# Altium project thymio2-main.PrjPCB (part 1 of 2)
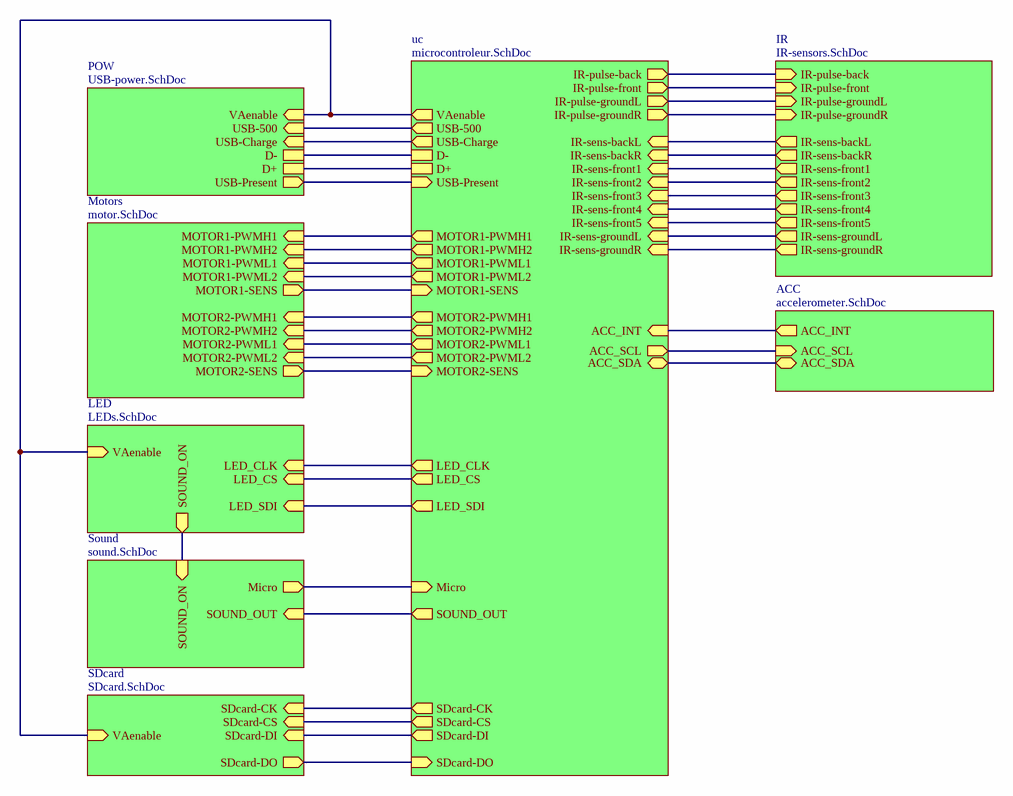
[diagram p0: thymio2-main.SchDoc]
Revision: 2.3
9 sheets, 376 parts. Net scope: hierarchical (ports join the sheet entries above them; power ports are global).
Board files: thymio2-main.PcbDoc, thymio2 capa touch round.PcbDoc
Sheets:
  thymio2-main.SchDoc
    uc = microcontroleur.SchDoc
    IR = IR-sensors.SchDoc
    POW = USB-power.SchDoc
    ACC = accelerometer.SchDoc
    LED = LEDs.SchDoc
    Motors = motor.SchDoc
    Sound = sound.SchDoc
    SDcard = SDcard.SchDoc

## Sheet thymio2-main.SchDoc: Thymio2
size A4; Organization: Original design LSRO-STI-EPFL; Address1: Association Mobsya; Address2: Michael Bonani; Address3: Ch. Closel 3; Address4: CH-1020 Renens; DocumentNumber: 1; Revision: 2.3; SheetNumber: 1; SheetTotal: 9; Engineer: Michael Bonani; Title2: PCB principal; ProjectName: Project Name

### Sub-sheets
ACC = accelerometer.SchDoc: ACC_INT (out), ACC_SCL (in), ACC_SDA (bidir)
IR = IR-sensors.SchDoc: IR-pulse-back (in), IR-pulse-front (in), IR-pulse-groundL (in), IR-pulse-groundR (in), IR-sens-backL (out), IR-sens-backR (out), IR-sens-front1 (out), IR-sens-front2 (out), IR-sens-front3 (out), IR-sens-front4 (out), IR-sens-front5 (out), IR-sens-groundL (out), IR-sens-groundR (out)
LED = LEDs.SchDoc: LED_CLK (in), LED_CS (in), LED_SDI (in), SOUND_ON (out), VAenable (in)
Motors = motor.SchDoc: MOTOR1-PWMH1 (in), MOTOR1-PWMH2 (in), MOTOR1-PWML1 (in), MOTOR1-PWML2 (in), MOTOR1-SENS (out), MOTOR2-PWMH1 (in), MOTOR2-PWMH2 (in), MOTOR2-PWML1 (in), MOTOR2-PWML2 (in), MOTOR2-SENS (out)
POW = USB-power.SchDoc: D+, D-, USB-500 (in), VAenable (in), USB-Charge (in), USB-Present (out)
SDcard = SDcard.SchDoc: SDcard-CK (in), SDcard-CS (in), SDcard-DI (in), SDcard-DO (out), VAenable (in)
Sound = sound.SchDoc: Micro (out), SOUND_ON (in), SOUND_OUT (in)
uc = microcontroleur.SchDoc: ACC_INT (in), ACC_SCL (out), ACC_SDA (bidir), IR-pulse-back (out), IR-pulse-front (out), IR-pulse-groundL (out), IR-pulse-groundR (out), IR-sens-backL (in), IR-sens-backR (in), IR-sens-front1 (in), IR-sens-front2 (in), IR-sens-front3 (in), IR-sens-front4 (in), IR-sens-front5 (in), IR-sens-groundL (in), IR-sens-groundR (in), MOTOR1-PWMH1 (out), MOTOR1-PWMH2 (out), MOTOR1-PWML1 (out), MOTOR1-PWML2 (out), MOTOR1-SENS (in), MOTOR2-PWMH1 (out), MOTOR2-PWMH2 (out), MOTOR2-PWML1 (out), MOTOR2-PWML2 (out), MOTOR2-SENS (in), D+, D-, USB-500 (out), VAenable (out), LED_CLK (out), LED_CS (out), LED_SDI (out), USB-Charge (out), Micro (in), SOUND_OUT (out), SDcard-CK (out), SDcard-CS (out), SDcard-DI (out), SDcard-DO (in), USB-Present (in)

### Nets
ACC_INT: sheet uc/ACC_INT, sheet ACC/ACC_INT
D_N: sheet uc/D-, sheet POW/D-
D_P: sheet uc/D+, sheet POW/D+
IR-pulse-back: sheet uc/IR-pulse-back, sheet IR/IR-pulse-back
IR-pulse-front: sheet uc/IR-pulse-front, sheet IR/IR-pulse-front
IR-pulse-groundL: sheet uc/IR-pulse-groundL, sheet IR/IR-pulse-groundL
IR-pulse-groundR: sheet uc/IR-pulse-groundR, sheet IR/IR-pulse-groundR
IR-sens-backL: sheet uc/IR-sens-backL, sheet IR/IR-sens-backL
IR-sens-backR: sheet uc/IR-sens-backR, sheet IR/IR-sens-backR
IR-sens-front1: sheet uc/IR-sens-front1, sheet IR/IR-sens-front1
IR-sens-front2: sheet uc/IR-sens-front2, sheet IR/IR-sens-front2
IR-sens-front3: sheet uc/IR-sens-front3, sheet IR/IR-sens-front3
IR-sens-front4: sheet uc/IR-sens-front4, sheet IR/IR-sens-front4
IR-sens-front5: sheet uc/IR-sens-front5, sheet IR/IR-sens-front5
IR-sens-groundL: sheet uc/IR-sens-groundL, sheet IR/IR-sens-groundL
IR-sens-groundR: sheet uc/IR-sens-groundR, sheet IR/IR-sens-groundR
LED_CLK: sheet uc/LED_CLK, sheet LED/LED_CLK
LED_CS: sheet uc/LED_CS, sheet LED/LED_CS
LED_SDI: sheet uc/LED_SDI, sheet LED/LED_SDI
Micro: sheet uc/Micro, sheet Sound/Micro
MOTOR1-PWMH1: sheet uc/MOTOR1-PWMH1, sheet Motors/MOTOR1-PWMH1
MOTOR1-PWMH2: sheet uc/MOTOR1-PWMH2, sheet Motors/MOTOR1-PWMH2
MOTOR1-PWML1: sheet uc/MOTOR1-PWML1, sheet Motors/MOTOR1-PWML1
MOTOR1-PWML2: sheet uc/MOTOR1-PWML2, sheet Motors/MOTOR1-PWML2
MOTOR1-SENS: sheet uc/MOTOR1-SENS, sheet Motors/MOTOR1-SENS
MOTOR2-PWMH1: sheet uc/MOTOR2-PWMH1, sheet Motors/MOTOR2-PWMH1
MOTOR2-PWMH2: sheet uc/MOTOR2-PWMH2, sheet Motors/MOTOR2-PWMH2
MOTOR2-PWML1: sheet uc/MOTOR2-PWML1, sheet Motors/MOTOR2-PWML1
MOTOR2-PWML2: sheet uc/MOTOR2-PWML2, sheet Motors/MOTOR2-PWML2
MOTOR2-SENS: sheet uc/MOTOR2-SENS, sheet Motors/MOTOR2-SENS
SCL: sheet uc/ACC_SCL, sheet ACC/ACC_SCL
SDA: sheet uc/ACC_SDA, sheet ACC/ACC_SDA
SDcard-CK: sheet uc/SDcard-CK, sheet SDcard/SDcard-CK
SDcard-CS: sheet uc/SDcard-CS, sheet SDcard/SDcard-CS
SDcard-DI: sheet uc/SDcard-DI, sheet SDcard/SDcard-DI
SDcard-DO: sheet uc/SDcard-DO, sheet SDcard/SDcard-DO
SOUND_ON: sheet LED/SOUND_ON, sheet Sound/SOUND_ON
SOUND_OUT: sheet uc/SOUND_OUT, sheet Sound/SOUND_OUT
USB-500: sheet uc/USB-500, sheet POW/USB-500
USB-Charge: sheet uc/USB-Charge, sheet POW/USB-Charge
USB-Present: sheet uc/USB-Present, sheet POW/USB-Present
VAenable: sheet uc/VAenable, sheet POW/VAenable, sheet LED/VAenable, sheet SDcard/VAenable

### Notes on the sheet
- Date:
- Project
- Part
- Revision:
- File :
- Page
- de

## Sheet microcontroleur.SchDoc: Thymio2
size A4; Organization: Original design LSRO-STI-EPFL; Address1: Association Mobsya; Address2: Michael Bonani; Address3: Ch. Closel 3; Address4: CH-1020 Renens; DocumentNumber: 2; Revision: 2.3; SheetNumber: 2; SheetTotal: 9; Engineer: Michael Bonani; Title2: PCB principal; ProjectName: Project Name
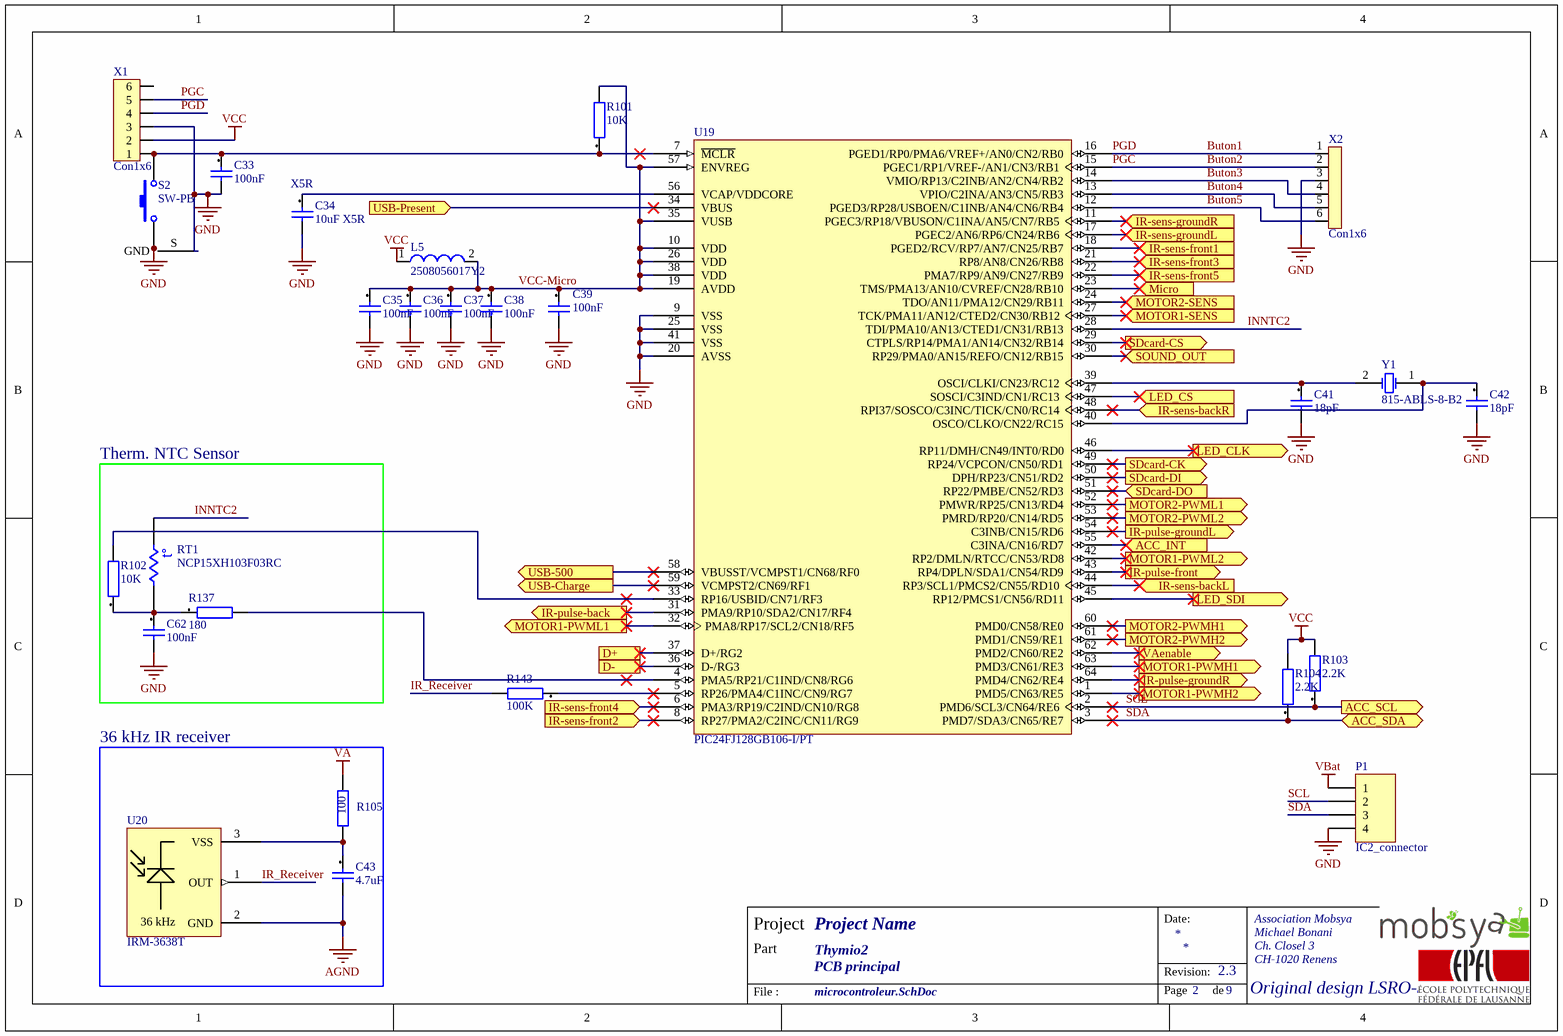
[diagram p1: microcontroleur.SchDoc]

### Parts
C33  100nF  [CAPC1005X05N]
C34  10uF X5R  Dielectric: X5R  [CAPC1005X05N]
C35  100nF  [CAPC1005X05N]
C36  100nF  [CAPC1005X05N]
C37  100nF  [CAPC1005X05N]
C38  100nF  [CAPC1005X05N]
C39  100nF  [CAPC1005X05N]
C41  18pF  [CAPC1005X05N]
C42  18pF  [CAPC1005X05N]
C43  4.7uF  [CAPC1005X05N]
C62  100nF  [CAPC1005X05N]
L5  2508056017Y2  [INDC2012X11L]
P1  IC2_connector  [HDR1X4]
R101  10K  [RESC1005X04N]
R102  10K  [RESC1005X04N]
R103  2.2K  [RESC1005X04N]
R104  2.2K  [RESC1005X04N]
R105  100  [RESC1005X04N]
R137  180  [RESC1005X04N]
R143  100K  [RESC1005X04N]
RT1  NCP15XH103F03RC  [RESC1005X04L]
S2  SW-PB  [FSMRA2JH]
U19  PIC24FJ128GB106-I/PT  [TQFP-PT64_N]
U20  IRM-3638T  [IR-receiver]
X1  Con1x6  [TYCO_7-215079-6]
X2  Con1x6  [MHDR1X6]
Y1  815-ABLS-8-B2  [HC49/4H_SMX]

### Blocks framed on the sheet
Therm. NTC Sensor: C62 R102 R137 RT1
36 kHz IR receiver: C43 R105 U20

### Ports
ACC_INT (in), ACC_SCL (out), ACC_SDA (bidir), D+, D-, IR-pulse-back (out), IR-pulse-front (out), IR-pulse-groundL (out), IR-pulse-groundR (out), IR-sens-backL (in), IR-sens-backR (in), IR-sens-front1 (in), IR-sens-front2 (in), IR-sens-front3 (in), IR-sens-front4 (in), IR-sens-front5 (in), IR-sens-groundL (in), IR-sens-groundR (in), LED_CLK (out), LED_CS (in), LED_SDI (out), Micro (in), MOTOR1-PWMH1 (out), MOTOR1-PWMH2 (out), MOTOR1-PWML1 (out), MOTOR1-PWML2 (out), MOTOR1-SENS (in), MOTOR2-PWMH1 (out), MOTOR2-PWMH2 (out), MOTOR2-PWML1 (out), MOTOR2-PWML2 (out), MOTOR2-SENS (in), SDcard-CK (out), SDcard-CS (out), SDcard-DI (out), SDcard-DO (in), SOUND_OUT (in), USB-500 (out), USB-Charge (out), USB-Present (in), VAenable (out)

### Nets
AGND: C43.2 U20.2(GND)
GND: C33.2 C34.2 C35.2 C36.2 C37.2 C38.2 C39.2 C41.2 C42.2 C62.2 P1.4 S2.1 S2.S(GND) U19.9(VSS) U19.20(AVSS) U19.25(VSS) U19.41(VSS) X1.3 X2.3
VA: R105.2
VBat: P1.1
VCC: L5.1 R103.2 R104.2 X1.2
ACC_INT: U19.55(C3INA/CN16/RD7) ; port ACC_INT
Buton1: U19.16(PGED1/RP0/PMA6/VREF+/AN0/CN2/RB0) X1.4 X2.1  [also labelled PGD]
Buton2: U19.15(PGEC1/RP1/VREF-/AN1/CN3/RB1) X1.5 X2.2  [also labelled PGC]
Buton3: U19.14(VMIO/RP13/C2INB/AN2/CN4/RB2) X2.4
Buton4: U19.13(VPIO/C2INA/AN3/CN5/RB3) X2.5
Buton5: U19.12(PGED3/RP28/USBOEN/C1INB/AN4/CN6/RB4) X2.6
D_N: U19.36(D-/RG3) ; port D-
D_P: U19.37(D+/RG2) ; port D+
INNTC2: RT1.1 U19.28(TDI/PMA10/AN13/CTED1/CN31/RB13)
IR-pulse-back: U19.31(PMA9/RP10/SDA2/CN17/RF4) ; port IR-pulse-back
IR-pulse-front: U19.43(RP4/DPLN/SDA1/CN54/RD9) ; port IR-pulse-front
IR-pulse-groundL: U19.54(C3INB/CN15/RD6) ; port IR-pulse-groundL
IR-pulse-groundR: U19.64(PMD4/CN62/RE4) ; port IR-pulse-groundR
IR-sens-backL: U19.44(RP3/SCL1/PMCS2/CN55/RD10) ; port IR-sens-backL
IR-sens-backR: U19.48(RPI37/SOSCO/C3INC/TICK/CN0/RC14) ; port IR-sens-backR
IR-sens-front1: U19.18(PGED2/RCV/RP7/AN7/CN25/RB7) ; port IR-sens-front1
IR-sens-front2: U19.8(RP27/PMA2/C2INC/CN11/RG9) ; port IR-sens-front2
IR-sens-front3: U19.21(RP8/AN8/CN26/RB8) ; port IR-sens-front3
IR-sens-front4: U19.6(PMA3/RP19/C2IND/CN10/RG8) ; port IR-sens-front4
IR-sens-front5: U19.22(PMA7/RP9/AN9/CN27/RB9) ; port IR-sens-front5
IR-sens-groundL: U19.17(PGEC2/AN6/RP6/CN24/RB6) ; port IR-sens-groundL
IR-sens-groundR: U19.11(PGEC3/RP18/VBUSON/C1INA/AN5/CN7/RB5) ; port IR-sens-groundR
IR_Receiver: R143.2 U20.1(OUT)
LED_CLK: U19.46(RP11/DMH/CN49/INT0/RD0) ; port LED_CLK
LED_CS: U19.47(SOSCI/C3IND/CN1/RC13) ; port LED_CS
LED_SDI: U19.45(RP12/PMCS1/CN56/RD11) ; port LED_SDI
Micro: U19.23(TMS/PMA13/AN10/CVREF/CN28/RB10) ; port Micro
MOTOR1-PWMH1: U19.63(PMD3/CN61/RE3) ; port MOTOR1-PWMH1
MOTOR1-PWMH2: U19.1(PMD5/CN63/RE5) ; port MOTOR1-PWMH2
MOTOR1-PWML1: U19.32(PMA8/RP17/SCL2/CN18/RF5) ; port MOTOR1-PWML1
MOTOR1-PWML2: U19.42(RP2/DMLN/RTCC/CN53/RD8) ; port MOTOR1-PWML2
MOTOR1-SENS: U19.27(TCK/PMA11/AN12/CTED2/CN30/RB12) ; port MOTOR1-SENS
MOTOR2-PWMH1: U19.60(PMD0/CN58/RE0) ; port MOTOR2-PWMH1
MOTOR2-PWMH2: U19.61(PMD1/CN59/RE1) ; port MOTOR2-PWMH2
MOTOR2-PWML1: U19.52(PMWR/RP25/CN13/RD4) ; port MOTOR2-PWML1
MOTOR2-PWML2: U19.53(PMRD/RP20/CN14/RD5) ; port MOTOR2-PWML2
MOTOR2-SENS: U19.24(TDO/AN11/PMA12/CN29/RB11) ; port MOTOR2-SENS
SCL: P1.2 R103.1 U19.2(PMD6/SCL3/CN64/RE6) ; port ACC_SCL
SDA: P1.3 R104.1 U19.3(PMD7/SDA3/CN65/RE7) ; port ACC_SDA
SDcard-CK: U19.49(RP24/VCPCON/CN50/RD1) ; port SDcard-CK
SDcard-CS: U19.29(CTPLS/RP14/PMA1/AN14/CN32/RB14) ; port SDcard-CS
SDcard-DI: U19.50(DPH/RP23/CN51/RD2) ; port SDcard-DI
SDcard-DO: U19.51(RP22/PMBE/CN52/RD3) ; port SDcard-DO
SOUND_OUT: U19.30(RP29/PMA0/AN15/REFO/CN12/RB15) ; port SOUND_OUT
USB-500: U19.58(VBUSST/VCMPST1/CN68/RF0) ; port USB-500
USB-Charge: U19.59(VCMPST2/CN69/RF1) ; port USB-Charge
USB-Present: U19.34(VBUS) ; port USB-Present
VAenable: U19.62(PMD2/CN60/RE2) ; port VAenable
VCC-Micro: C35.1 C36.1 C37.1 C38.1 C39.1 L5.2 R101.2 U19.10(VDD) U19.19(AVDD) U19.26(VDD) U19.35(VUSB) U19.38(VDD) U19.57(ENVREG)
NetC33_1: C33.1 R101.1 S2.2 U19.7(~{MCLR}) X1.1
NetC34_1: C34.1 U19.56(VCAP/VDDCORE)
NetC41_1: C41.1 U19.39(OSCI/CLKI/CN23/RC12) Y1.2(OSC2)
NetC42_1: C42.1 U19.40(OSCO/CLKO/CN22/RC15) Y1.1(OSC1)
NetC43_1: C43.1 R105.1 U20.3(VSS)
NetC62_1: C62.1 R102.1 R137.1 RT1.2
NetR102_2: R102.2 U19.33(RP16/USBID/CN71/RF3)
NetR137_2: R137.2 U19.4(PMA5/RP21/C1IND/CN8/RG6)
NetR143_1: R143.1 U19.5(RP26/PMA4/C1INC/CN9/RG7)

Not connected (* = marked no-connect by the designer): X1 6

### Notes on the sheet
- Date:
- Project
- Part
- Revision:
- File :
- Page
- de
- (in symbol Res Thermal) t°
- (in symbol TSOP32236) 36 kHz

### Library data of the parts
C33 C35-C39 C62 = 100nF[[/\]]0603[[/\]]1: Capacitor; Manufacturer: Kemet; Manufacturer Nr: C0603C104K5RAC; Preference: 1; Tolerance +: +10; Tolerance -: -10; Dielectric: X7R; Voltage: 50; MaxTemperature: +125; MinTemperature: -55; Quant_1: 10; Quant_2: 100; Quant_3: 1000; Quant_4: 4000; Currentie: CHF; LayerSch: Top; Size: 0603; Footprint Acort: 0603_G; Supplier: Farnell; Supplier Nr: 1288255; ComponentLink2Description: Farnell link; ComponentLink2URL: http://ch.farnell.com/jsp/displayProduct.jsp?sku=1288255; Price_1: 0.046; Price_2: 0.04; Price_3: 0.037; Price_4: 0.036; ROHS: True; DateLastUpdate: 2007-12-03 / 14:22:31
C34 = 10uF[[/\]]0603[[/\]]1: Capacitor; Manufacturer: Taiyo Yuden; Manufacturer Nr: JMK107BJ106MA-T; Preference: 1; Tolerance +: +15; Tolerance -: -15; Voltage: 6.3; MaxTemperature: +85; MinTemperature: -55; Quant_2: 100; Quant_3: 500; Currentie: CHF; LayerSch: Top; Size: 0603; Footprint Acort: 0603_G; Supplier: Farnell; Supplier Nr: 1463375; ComponentLink2Description: Farnell link; ComponentLink2URL: http://ch.farnell.com/jsp/displayProduct.jsp?sku=1463375; Quant_1: 1; Price_1: 0.768; Price_2: 0.674; Price_3: 0.372; ROHS: True; DateLastUpdate: 2007-12-03 / 14:22:36
C41 C42 = 10pF[[/\]]0603[[/\]]3: Manufacturer: Murata; Manufacturer Nr: GRM1885C1H100JA01D; Preference: 3; Tolerance +: +5; Tolerance -: -5; Dielectric: COG; Voltage: 50; MaxTemperature: +125; MinTemperature: -55; Quant_1: 10; Quant_2: 100; Quant_3: 500; Quant_4: 1000; Quant_5: 4000; Quant_6: 8000; Currentie: CHF; Size: 0603; Footprint Acort: 0603_G; Supplier: Farnell; Supplier Nr: 8819815; ComponentLink2Description: Farnell link; ComponentLink2URL: http://ch.farnell.com/jsp/displayProduct.jsp?sku=8819815; Price_1: 0.071; Price_2: 0.061; Price_3: 0.051; Price_4: 0.041; Price_5: 0.031; Price_6: 0.02; ROHS: True; DateLastUpdate: 2007-12-03 / 14:22:35
C43 = 4.7uF[[/\]]0603[[/\]]1: Capacitor; Manufacturer: Kemet; Manufacturer Nr: C0603C475K9PAC; Preference: 1; Tolerance +: +10; Tolerance -: -10; Dielectric: X5R; Voltage: 6.3; MaxTemperature: +85; MinTemperature: -55; Quant_1: 10; Quant_2: 100; Quant_3: 1000; Quant_4: 4000; Currentie: CHF; Size: 0603; Footprint Acort: 0603_G; Supplier: Farnell; Supplier Nr: 9227784; ComponentLink2Description: Farnell link; ComponentLink2URL: http://ch.farnell.com/jsp/displayProduct.jsp?sku=9227784; Price_1: 0.33; Price_2: 0.298; Price_3: 0.278; Price_4: 0.246; ROHS: True; DateLastUpdate: 2007-12-03 / 14:22:57
L5 = 74279204: SMD EMI Suppression Ferrite Bead WE-CBF, Z = 600 Ohm; Impedance: 600 Ohm; PackageReference: SMD-0805; PackageDescription: Chip Inductor, 2-Leads, Body 2.0 x 1.2 mm; PartNumber: 2508056017Y2; ComponentLink1Description: Fair-Rite; ComponentLink2Description: https://www.mouser.ch/datasheet/2/150/2508056017Y2-472219.pdf
P1 = Header 4: Header, 4-Pin; LatestRevisionDate: 17-Jul-2002; LatestRevisionNote: Re-released for DXP Platform.; Publisher: Altium Limited
R101 R102 = 10K[[/\]]0603[[/\]]2: Resistor; Manufacturer: Multicomp; Manufacturer Nr: MC 0.063W 0603 1% 10K; Tolerance: +/-1; Preference: 2; Power: 0.063; Voltage: 50; Current: 1; ppm/K: +/-100; Quant_2: 250; Quant_3: 1000; Quant_4: 5000; Quant_5: 15000; Currentie: CHF; LayerSch: Top; Size: 0603; Footprint Acort: 0603; ComponentLink1Description: OnLine datasheet; Supplier: Farnell; Supplier Nr: 9330399; ComponentLink2Description: Farnell link; ComponentLink2URL: http://ch.farnell.com/jsp/displayProduct.jsp?sku=9330399; ROHS: True; Quant_1: 50; Price_1: 0.062; Price_2: 0.049; Price_3: 0.038; Price_4: 0.027; Price_5: 0.021; DateLastUpdate: 2007-11-29 / 09:14:40
R103 R104 = 4.7K[[/\]]0603[[/\]]1: Resistor; Manufacturer: Vishay; Manufacturer Nr: D11CRCW06030B4701F; Tolerance: +/-1; Preference: 1; Power: 0.1; Voltage: 75; Current: 1.5; ppm/K: +/-100; Quant_1: 10; Quant_2: 100; Quant_3: 500; Currentie: CHF; LayerSch: Top; Size: 0603; Footprint Acort: 0603; Supplier: Distrelec; Supplier Nr: 715604; ComponentLink2Description: Distrelec link; ComponentLink2URL: http://www.distrelec.com/ishopWebFront/search/luceneSearch.do?dispatch=find&showImage=on&artnrPhrase=715604; ROHS: True; Price_1: 0.0538; Price_2: 0.0323; Price_3: 0.0204; DateLastUpdate: 2007-12-03 / 16:30:20
R105 = RES_ACORT: Resistance; ClassName: IR
R137 = 180R[[/\]]0603[[/\]]1: Resistor; Manufacturer: Vishay; Manufacturer Nr: D11CRCW06030B4703F; Tolerance: +/-1; Preference: 1; Power: 0.1; Voltage: 75; Current: 1.5; ppm/K: +/-100; Quant_1: 10; Quant_2: 100; Quant_3: 500; Currentie: CHF; LayerSch: Top; Size: 0603; Footprint Acort: 0603; Supplier: Distrelec; Supplier Nr: 715570; ComponentLink2Description: Distrelec link; ComponentLink2URL: http://www.distrelec.com/ishopWebFront/search/luceneSearch.do?dispatch=find&showImage=on&artnrPhrase=715570; ROHS: True; Price_1: 0.0538; Price_2: 0.0323; Price_3: 0.0204; DateLastUpdate: 2007-12-03 / 16:30:19
R143 = 100K[[/\]]0603[[/\]]1: Resistor; Manufacturer: Vishay; Manufacturer Nr: D11CRCW06030B1003F; Tolerance: +/-1; Preference: 1; Power: 0.1; Voltage: 75; Current: 1.5; ppm/K: +/-100; Quant_1: 10; Quant_2: 100; Quant_3: 500; Currentie: CHF; Size: 0603; Footprint Acort: 0603; ComponentLink1Description: OnLine datasheet; Supplier: Distrelec; Supplier Nr: 715636; ComponentLink2Description: Distrelec link; ComponentLink2URL: http://www.distrelec.com/ishopWebFront/search/luceneSearch.do?dispatch=find&showImage=on&artnrPhrase=715636; ROHS: True; Price_1: 0.0538; Price_2: 0.0323; Price_3: 0.0204; DateLastUpdate: 2007-12-03 / 16:29:58
RT1 = Res Thermal: Thermistors - NTC 10K OHM 1% 0402; LayerSch: Top; Published: 24-Mar-1999; LatestRevisionDate: 29-May-2009; LatestRevisionNote: IPC-7351 Footprint Added.; PackageVersion: Mar-2003; PackageReference: 6-0805; Publisher: Altium Limited; PackageDescription: Chip Resistor 0805 Case Size; Code_IPC: RESC2012
S2 = SW-PB: Switch; Published: 24-Mar-1999; LatestRevisionDate: 17-Jul-2002; LatestRevisionNote: Re-released for DXP Platform.; PackageReference: SPST-2; Publisher: Altium Limited
U19 = PIC24FJ128GB106-I/PT: General Purpose 16-Bit Flash Microcontroller with USB On-The-Go, 128KB Flash, 16KB SRAM, 64-Pin TQFP, Industrial Temperature; FirstPublished: 29-Jan-2009; DatasheetVersion: revB, Mar-2008; PackageVersion: revBB, Aug-2009; PackageReference: TQFP-PT64; Publisher: Altium Limited; PackageDescription: 64-Lead Thin Plastic Quad Flat Pack (PT) - 10x10x1mm Body, 2.00mm [TQFP]; Supplier 1: Digi-Key; Supplier Part Number 1: PIC24FJ128GB106-I/PT-ND; Supplier 2: Farnell; Supplier Part Number 2: 1576850; Supplier 3: Newark; Supplier Part Number 3: 54M5097; Code_JEDEC: MS-026; ComponentLink1Description: Datasheet; ComponentLink1URL: http://ww1.microchip.com/downloads/en/DeviceDoc/39897b.pdf; ComponentLink2Description: Packaging Specification; ComponentLink2URL: http://www.microchip.com/stellent/groups/techpub_sg/documents/packagingspec/en012702.pdf; ComponentLink3Description: Microchip.com Home; ComponentLink3URL: http://www.microchip.com/
U20 = TSOP32236: IR Receiver Module (38 kHz) for Remote Control Systems; LayerSch: Top; Farnell: 4913103; ClassName: IR
X1 = Con1x6_1: 1 x 6 pins connector
X2 = Con1x6: 1 x 6 pins connector; LayerSch: Top
Y1 = HC49/4H_SMX: Surface Mount Quartz Crystal 8Mhz; Note: PCB layout complies with manufacturer's recommendation.; Published: 17-Jul-2002; DatasheetDocument: 18-Oct-1999; PackageDocument: 18-Oct-1999; PackageReference: HC49/4H_SMX; Publisher: Altium Limited; ComponentLink1Description: Manufacturer Link; ComponentLink1URL: http://www.cmac.com/mt/; ComponentLink2Description: Datasheet; ComponentLink2URL: http://www.cmac.com/mt/databook/crystals/smd/hc49_4h_smx.pdf

## Sheet IR-sensors.SchDoc: Thymio2
size A3; Organization: Original design LSRO-STI-EPFL; Address1: Association Mobsya; Address2: Michael Bonani; Address3: Ch. Closel 3; Address4: CH-1020 Renens; DocumentNumber: 4; Revision: 2.3; SheetNumber: 4; SheetTotal: 9; Engineer: Michael Bonani; Title2: PCB principal; ProjectName: Project Name
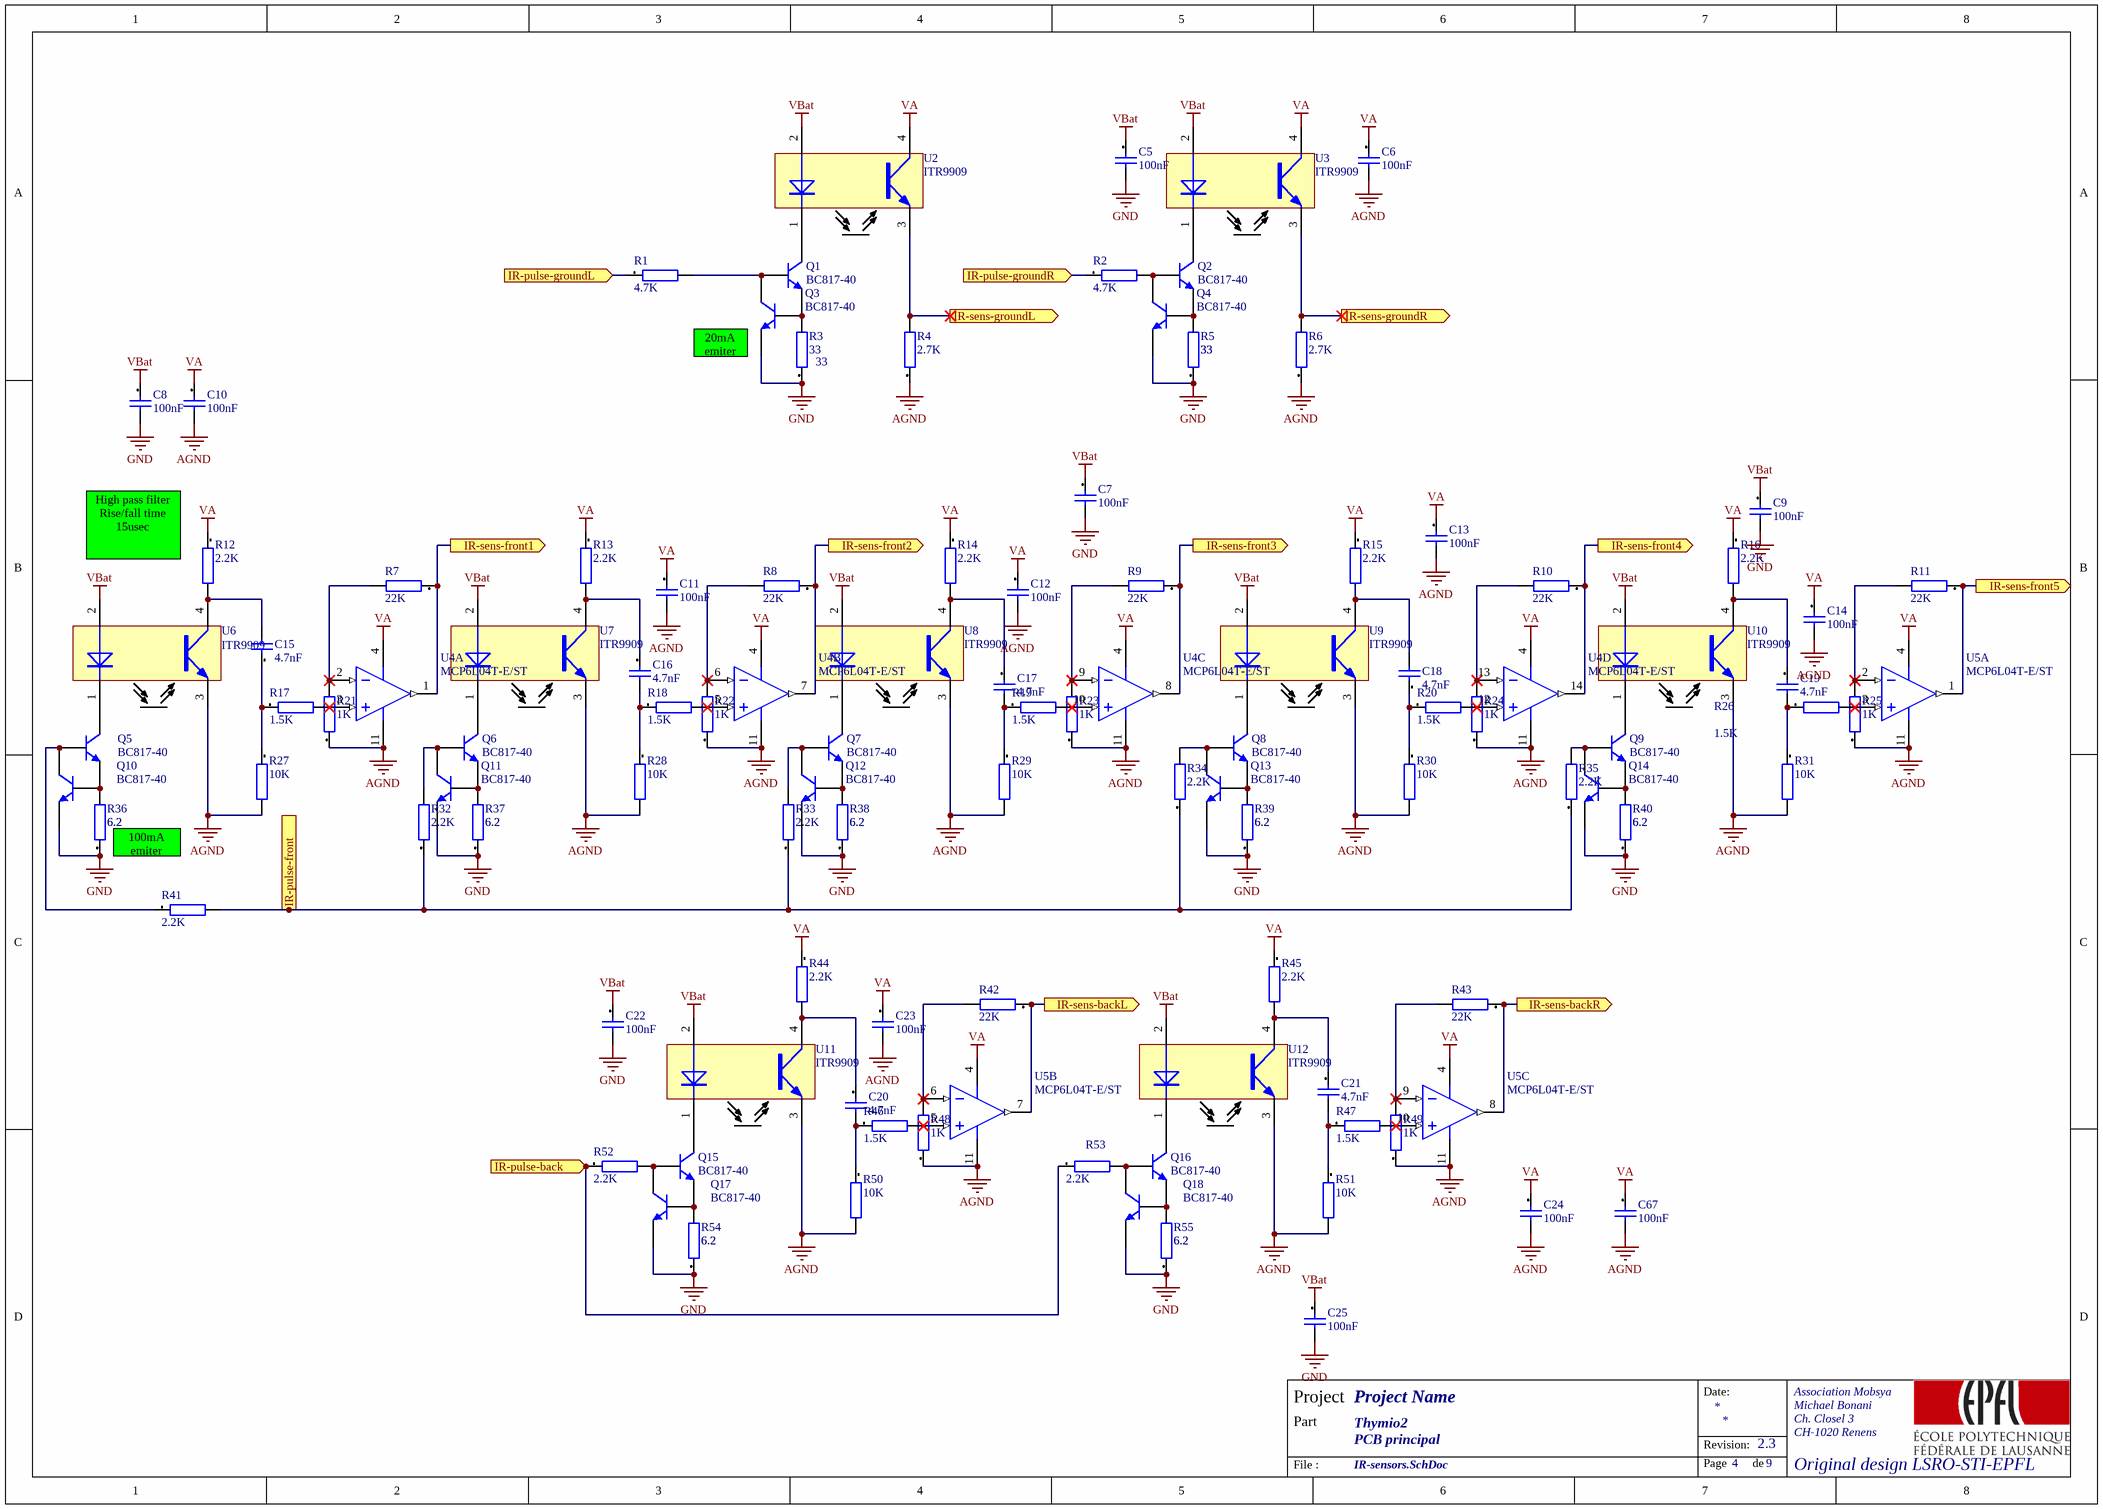
[diagram p2: IR-sensors.SchDoc]

### Parts
C5  100nF  [CAPC1005X05N]
C6  100nF  [CAPC1005X05N]
C7  100nF  [CAPC1005X05N]
C8  100nF  [CAPC1005X05N]
C9  100nF  [CAPC1005X05N]
C10  100nF  [CAPC1005X05N]
C11  100nF  [CAPC1005X05N]
C12  100nF  [CAPC1005X05N]
C13  100nF  [CAPC1005X05N]
C14  100nF  [CAPC1005X05N]
C15  4.7nF  [CAPC1005X05N]
C16  4.7nF  [CAPC1005X05N]
C17  4.7nF  [CAPC1005X05N]
C18  4.7nF  [CAPC1005X05N]
C19  4.7nF  [CAPC1005X05N]
C20  4.7nF  [CAPC1005X05N]
C21  4.7nF  [CAPC1005X05N]
C22  100nF  [CAPC1005X05N]
C23  100nF  [CAPC1005X05N]
C24  100nF  [CAPC1005X05N]
C25  100nF  [CAPC1005X05N]
C67  100nF  [CAPC1005X05N]
Q1  BC817-40  [SOT23_N]
Q2  BC817-40  [SOT23_N]
Q3  BC817-40  [SOT23_N]
Q4  BC817-40  [SOT23_N]
Q5  BC817-40  [SOT23_N]
Q6  BC817-40  [SOT23_N]
Q7  BC817-40  [SOT23_N]
Q8  BC817-40  [SOT23_N]
Q9  BC817-40  [SOT23_N]
Q10  BC817-40  [SOT23_N]
Q11  BC817-40  [SOT23_N]
Q12  BC817-40  [SOT23_N]
Q13  BC817-40  [SOT23_N]
Q14  BC817-40  [SOT23_N]
Q15  BC817-40  [SOT23_N]
Q16  BC817-40  [SOT23_N]
Q17  BC817-40  [SOT23_N]
Q18  BC817-40  [SOT23_N]
R1  4.7K  [RESC1005X04N]
R2  4.7K  [RESC1005X04N]
R3  33  [RESC1005X04N]
R4  2.7K  [RESC1005X04N]
R5  33  [RESC1005X04N]
R6  2.7K  [RESC1005X04N]
R7  22K  [RESC1005X04N]
R8  22K  [RESC1005X04N]
R9  22K  [RESC1005X04N]
R10  22K  [RESC1005X04N]
R11  22K  [RESC1005X04N]
R12  2.2K  [RESC1005X04N]
R13  2.2K  [RESC1005X04N]
R14  2.2K  [RESC1005X04N]
R15  2.2K  [RESC1005X04N]
R16  2.2K  [RESC1005X04N]
R17  1.5K  [RESC1005X04N]
R18  1.5K  [RESC1005X04N]
R19  1.5K  [RESC1005X04N]
R20  1.5K  [RESC1005X04N]
R21  1K  [RESC1005X04N]
R22  1K  [RESC1005X04N]
R23  1K  [RESC1005X04N]
R24  1K  [RESC1005X04N]
R25  1K  [RESC1005X04N]
R26  1.5K  [RESC1005X04N]
R27  10K  [RESC1005X04N]
R28  10K  [RESC1005X04N]
R29  10K  [RESC1005X04N]
R30  10K  [RESC1005X04N]
R31  10K  [RESC1005X04N]
R32  2.2K  [RESC1005X04N]
R33  2.2K  [RESC1005X04N]
R34  2.2K  [RESC1005X04N]
R35  2.2K  [RESC1005X04N]
R36  6.2  [RESC1005X04N]
R37  6.2  [RESC1005X04N]
R38  6.2  [RESC1005X04N]
R39  6.2  [RESC1005X04N]
R40  6.2  [RESC1005X04N]
R41  2.2K  [RESC1005X04N]
R42  22K  [RESC1005X04N]
R43  22K  [RESC1005X04N]
R44  2.2K  [RESC1005X04N]
R45  2.2K  [RESC1005X04N]
R46  1.5K  [RESC1005X04N]
R47  1.5K  [RESC1005X04N]
R48  1K  [RESC1005X04N]
R49  1K  [RESC1005X04N]
R50  10K  [RESC1005X04N]
R51  10K  [RESC1005X04N]
R52  2.2K  [RESC1005X04N]
R53  2.2K  [RESC1005X04N]
R54  6.2  [RESC1005X04N]
R55  6.2  [RESC1005X04N]
U2  ITR9909  [ITR9909_LONG]
U3  ITR9909  [ITR9909_LONG]
U4  MCP6L04T-E/ST  [TSSOP-ST14_N]  (parts A,B,C,D of 4)
U5  MCP6L04T-E/ST  [TSSOP-ST14_N]  (parts A,B,C of 4)
U6  ITR9909  [ITR9909_EDGE]
U7  ITR9909  [ITR9909_EDGE]
U8  ITR9909  [ITR9909_EDGE]
U9  ITR9909  [ITR9909_EDGE]
U10  ITR9909  [ITR9909_EDGE]
U11  ITR9909  [ITR9909_EDGE]
U12  ITR9909  [ITR9909_EDGE]

### Ports
IR-pulse-back (in), IR-pulse-front (in), IR-pulse-groundL (in), IR-pulse-groundR (in), IR-sens-backL (out), IR-sens-backR (out), IR-sens-front1 (out), IR-sens-front2 (out), IR-sens-front3 (out), IR-sens-front4 (out), IR-sens-front5 (out), IR-sens-groundL (out), IR-sens-groundR (out)

### Nets
AGND: C6.2 C10.2 C11.2 C12.2 C13.2 C14.2 C23.2 C24.2 C67.2 R4.1 R6.1 R21.1 R22.1 R23.1 R24.1 R25.1 R27.2 R28.2 R29.2 R30.2 R31.2 R48.1 R49.1 R50.2 R51.2 U4.11(VSS) U5.11(VSS) U6.3(E) U7.3(E) U8.3(E) U9.3(E) U10.3(E) U11.3(E) U12.3(E)
GND: C5.2 C7.2 C8.2 C9.2 C22.2 C25.2 Q3.2(E) Q4.2(E) Q10.2(E) Q11.2(E) Q12.2(E) Q13.2(E) Q14.2(E) Q17.2(E) Q18.2(E) R3.1 R5.1 R36.1 R37.1 R38.1 R39.1 R40.1 R54.1 R55.1
VA: C6.1 C10.1 C11.1 C12.1 C13.1 C14.1 C23.1 C24.1 C67.1 R12.1 R13.1 R14.1 R15.1 R16.1 R44.1 R45.1 U2.4(C) U3.4(C) U4.4(VDD) U5.4(VDD)
VBat: C5.1 C7.1 C8.1 C9.1 C22.1 C25.1 U2.2(A) U3.2(A) U6.2(A) U7.2(A) U8.2(A) U9.2(A) U10.2(A) U11.2(A) U12.2(A)
IR-pulse-back: R52.1 R53.1 ; port IR-pulse-back
IR-pulse-front: R32.1 R33.1 R34.1 R35.1 R41.2 ; port IR-pulse-front
IR-pulse-groundL: R1.1 ; port IR-pulse-groundL
IR-pulse-groundR: R2.1 ; port IR-pulse-groundR
IR-sens-backL: R42.1 U5.7(VOUTB) ; port IR-sens-backL
IR-sens-backR: R43.1 U5.8(VOUTC) ; port IR-sens-backR
IR-sens-front1: R7.1 U4.1(VOUTA) ; port IR-sens-front1
IR-sens-front2: R8.1 U4.7(VOUTB) ; port IR-sens-front2
IR-sens-front3: R9.1 U4.8(VOUTC) ; port IR-sens-front3
IR-sens-front4: R10.1 U4.14(VOUTD) ; port IR-sens-front4
IR-sens-front5: R11.1 U5.1(VOUTA) ; port IR-sens-front5
IR-sens-groundL: R4.2 U2.3(E) ; port IR-sens-groundL
IR-sens-groundR: R6.2 U3.3(E) ; port IR-sens-groundR
NetC15_1: C15.1 R17.1 R27.1
NetC15_2: C15.2 R12.2 U6.4(C)
NetC16_1: C16.1 R13.2 U7.4(C)
NetC16_2: C16.2 R18.1 R28.1
NetC17_1: C17.1 R14.2 U8.4(C)
NetC17_2: C17.2 R19.1 R29.1
NetC18_1: C18.1 R20.1 R30.1
NetC18_2: C18.2 R15.2 U9.4(C)
NetC19_1: C19.1 R16.2 U10.4(C)
NetC19_2: C19.2 R26.1 R31.1
NetC20_1: C20.1 R44.2 U11.4(C)
NetC20_2: C20.2 R46.1 R50.1
NetC21_1: C21.1 R45.2 U12.4(C)
NetC21_2: C21.2 R47.1 R51.1
NetQ1_1: Q1.1(B) Q3.3(C) R1.2
NetQ1_2: Q1.2(E) Q3.1(B) R3.2
NetQ1_3: Q1.3(C) U2.1(C)
NetQ2_1: Q2.1(B) Q4.3(C) R2.2
NetQ2_2: Q2.2(E) Q4.1(B) R5.2
NetQ2_3: Q2.3(C) U3.1(C)
NetQ5_1: Q5.1(B) Q10.3(C) R41.1
NetQ5_2: Q5.2(E) Q10.1(B) R36.2
NetQ5_3: Q5.3(C) U6.1(C)
NetQ6_1: Q6.1(B) Q11.3(C) R32.2
NetQ6_2: Q6.2(E) Q11.1(B) R37.2
NetQ6_3: Q6.3(C) U7.1(C)
NetQ7_1: Q7.1(B) Q12.3(C) R33.2
NetQ7_2: Q7.2(E) Q12.1(B) R38.2
NetQ7_3: Q7.3(C) U8.1(C)
NetQ8_1: Q8.1(B) Q13.3(C) R34.2
NetQ8_2: Q8.2(E) Q13.1(B) R39.2
NetQ8_3: Q8.3(C) U9.1(C)
NetQ9_1: Q9.1(B) Q14.3(C) R35.2
NetQ9_2: Q9.2(E) Q14.1(B) R40.2
NetQ9_3: Q9.3(C) U10.1(C)
NetQ15_1: Q15.1(B) Q17.3(C) R52.2
NetQ15_2: Q15.2(E) Q17.1(B) R54.2
NetQ15_3: Q15.3(C) U11.1(C)
NetQ16_1: Q16.1(B) Q18.3(C) R53.2
NetQ16_2: Q16.2(E) Q18.1(B) R55.2
NetQ16_3: Q16.3(C) U12.1(C)
NetR7_2: R7.2 R21.2 U4.2(VINA-)
NetR8_2: R8.2 R22.2 U4.6(VINB-)
NetR9_2: R9.2 R23.2 U4.9(VINC-)
NetR10_2: R10.2 R24.2 U4.13(VIND-)
NetR11_2: R11.2 R25.2 U5.2(VINA-)
NetR17_2: R17.2 U4.3(VINA+)
NetR18_2: R18.2 U4.5(VINB+)
NetR19_2: R19.2 U4.10(VINC+)
NetR20_2: R20.2 U4.12(VIND+)
NetR26_2: R26.2 U5.3(VINA+)
NetR42_2: R42.2 R48.2 U5.6(VINB-)
NetR43_2: R43.2 R49.2 U5.9(VINC-)
NetR46_2: R46.2 U5.5(VINB+)
NetR47_2: R47.2 U5.10(VINC+)

### Notes on the sheet
- (near Q3) 20mA emiter
- (near R12) High pass filter
  Rise/fall time 15usec
- (near R36) 100mA emiter
- Date:
- Project
- Part
- Revision:
- File :
- Page
- de

### Library data of the parts
C5 C7-C9 C14 C22 C25 = 100nF[[/\]]0603[[/\]]1: Capacitor; Manufacturer: Kemet; Manufacturer Nr: C0603C104K5RAC; Preference: 1; Tolerance +: +10; Tolerance -: -10; Dielectric: X7R; Voltage: 50; MaxTemperature: +125; MinTemperature: -55; Quant_1: 10; Quant_2: 100; Quant_3: 1000; Quant_4: 4000; Currentie: CHF; Size: 0603; Footprint Acort: 0603_G; Supplier: Farnell; Supplier Nr: 1288255; ComponentLink2Description: Farnell link; ComponentLink2URL: http://ch.farnell.com/jsp/displayProduct.jsp?sku=1288255; Price_1: 0.046; Price_2: 0.04; Price_3: 0.037; Price_4: 0.036; ROHS: True; DateLastUpdate: 2007-12-03 / 14:22:31
C6 C10-C13 C23 C24 C67 = 100nF[[/\]]0603[[/\]]1: as C33 on sheet microcontroleur; Size: 0603; Footprint Acort: 0603_G; Supplier: Farnell; Supplier Nr: 1288255; ComponentLink2Description: Farnell link; ComponentLink2URL: http://ch.farnell.com/jsp/displayProduct.jsp?sku=1288255; Price_1: 0.046; Price_2: 0.04; Price_3: 0.037; Price_4: 0.036; ROHS: True; DateLastUpdate: 2007-12-03 / 14:22:31
C15-C21 = CAP-NP: Capacitor
Q1-Q4 Q7 Q12 = BC817-40: NPN General-purpose Transistor; Published: 17-Sep-2003; LatestRevisionDate: 12-Dec-2006; LatestRevisionNote: IPC-7351 Footprint Added.; DatasheetVersion: Jun-1999; PackageVersion: May-1999; PackageReference: SOT23; Publisher: Altium Limited; PackageDescription: 3-Pin SOT-23 Package 0.95 mm Pitch, 2.3 mm Lead Span; ComponentLink1Description: Manufacturer Link; ComponentLink1URL: http://www.semiconductors.philips.com/; ComponentLink2Description: Datasheet; ComponentLink2URL: http://www.semiconductors.philips.com/acrobat/datasheets/BC817_BC817W_BC337_5.pdf
Q5 Q6 Q8-Q11 Q13-Q18 = BC817-40: NPN General-purpose Transistor; LayerSch: Top; Published: 17-Sep-2003; LatestRevisionDate: 12-Dec-2006; LatestRevisionNote: IPC-7351 Footprint Added.; DatasheetVersion: Jun-1999; PackageVersion: May-1999; PackageReference: SOT23; Publisher: Altium Limited; PackageDescription: 3-Pin SOT-23 Package 0.95 mm Pitch, 2.3 mm Lead Span; ComponentLink1Description: Manufacturer Link; ComponentLink1URL: http://www.semiconductors.philips.com/; ComponentLink2Description: Datasheet; ComponentLink2URL: http://www.semiconductors.philips.com/acrobat/datasheets/BC817_BC817W_BC337_5.pdf
R1 R2 = 4.7K[[/\]]0603[[/\]]1: Resistor; Manufacturer: Vishay; Manufacturer Nr: D11CRCW06030B4701F; Tolerance: +/-1; Preference: 1; Power: 0.1; Voltage: 75; Current: 1.5; ppm/K: +/-100; Quant_1: 10; Quant_2: 100; Quant_3: 500; Currentie: CHF; Size: 0603; Footprint Acort: 0603; Supplier: Distrelec; Supplier Nr: 715604; ComponentLink2Description: Distrelec link; ComponentLink2URL: http://www.distrelec.com/ishopWebFront/search/luceneSearch.do?dispatch=find&showImage=on&artnrPhrase=715604; ROHS: True; Price_1: 0.0538; Price_2: 0.0323; Price_3: 0.0204; DateLastUpdate: 2007-12-03 / 16:30:20
R3 R7-R10 R12-R24 R27-R31 R38 R44 R45 R50 R51 = RES: 120
  R3: Value: 33
  R7-R10: Value: 22k
  R12-R16 R44 R45: Value: 2.2k
  R17-R20: Value: 1.5k
  R21-R24: Value: 1k
  R27-R31 R50 R51: Value: 10k
  R38: Value: 6.2
R4 R6 = RES: Resistor; Value: 1k
R5 = RES: Resistor; Value: 33
R11 R25 R26 R36 R37 R39 R40 R42 R43 R46-R49 R54 R55 = RES: 120; LayerSch: Top
  R11 R42 R43: Value: 22k
  R25 R48 R49: Value: 1k
  R26 R46 R47: Value: 1.5k
  R36 R37 R39 R40 R54 R55: Value: 6.2
R32 R34 R35 R41 R52 R53 = 2.2K[[/\]]0603[[/\]]1: Resistor; Manufacturer: Vishay; Manufacturer Nr: D11CRCW06030B2201F; Tolerance: +/-1; Preference: 1; Power: 0.1; Voltage: 75; Current: 1.5; ppm/K: +/-100; Quant_1: 10; Quant_2: 100; Quant_3: 500; Currentie: CHF; LayerSch: Top; Size: 0603; Footprint Acort: 0603; Supplier: Distrelec; Supplier Nr: 715596; ComponentLink2Description: Distrelec link; ComponentLink2URL: http://www.distrelec.com/ishopWebFront/search/luceneSearch.do?dispatch=find&showImage=on&artnrPhrase=715596; ROHS: True; Price_1: 0.085; Price_2: 0.0603; Price_3: 0.0247; DateLastUpdate: 2009-06-10 / 12:36:43
R33 = 2.2K[[/\]]0603[[/\]]1: Resistor; Manufacturer: Vishay; Manufacturer Nr: D11CRCW06030B2201F; Tolerance: +/-1; Preference: 1; Power: 0.1; Voltage: 75; Current: 1.5; ppm/K: +/-100; Quant_1: 10; Quant_2: 100; Quant_3: 500; Currentie: CHF; Size: 0603; Footprint Acort: 0603; Supplier: Distrelec; Supplier Nr: 715596; ComponentLink2Description: Distrelec link; ComponentLink2URL: http://www.distrelec.com/ishopWebFront/search/luceneSearch.do?dispatch=find&showImage=on&artnrPhrase=715596; ROHS: True; Price_1: 0.085; Price_2: 0.0603; Price_3: 0.0247; DateLastUpdate: 2009-06-10 / 12:36:43
U2 U3 = ITR9909: Everlight Opto Interrupter
U4 = MCP6L04T-E/ST: 1 MHz, 85 µA Quad Op Amp, 14-Pin TSSOP, Extended Temperature Range, Tape and Reel; FirstPublished: 2-Dec-2009; DatasheetVersion: revA, Mar-2009; PackageVersion: revBB, Aug-2009; PackageReference: TSSOP-ST14; Publisher: Altium Limited; PackageDescription: 14-Lead Plastic Thin Shrink Small Outline (ST) - 4.4mm Body [TSSOP]; Supplier 1: Digi-Key; Supplier Part Number 1: MCP6L04T-E/STTR-ND; Supplier 2: Digi-Key; Supplier Part Number 2: MCP6L04T-E/STDKR-ND; Supplier 3: Digi-Key; Supplier Part Number 3: MCP6L04T-E/STCT-ND; Supplier 4: Newark; Supplier Part Number 4: 08R1815; ComponentLink1Description: Datasheet; ComponentLink1URL: http://ww1.microchip.com/downloads/en/DeviceDoc/22140a.pdf; ComponentLink2Description: Packaging Specification; ComponentLink2URL: http://www.microchip.com/stellent/groups/techpub_sg/documents/packagingspec/en012702.pdf; ComponentLink3Description: Microchip.com Home; ComponentLink3URL: http://www.microchip.com/
U5 = MCP6L04T-E/ST: 1 MHz, 85 µA Quad Op Amp, 14-Pin TSSOP, Extended Temperature Range, Tape and Reel; LayerSch: Top; FirstPublished: 2-Dec-2009; DatasheetVersion: revA, Mar-2009; PackageVersion: revBB, Aug-2009; PackageReference: TSSOP-ST14; Publisher: Altium Limited; PackageDescription: 14-Lead Plastic Thin Shrink Small Outline (ST) - 4.4mm Body [TSSOP]; Supplier 1: Digi-Key; Supplier Part Number 1: MCP6L04T-E/STTR-ND; Supplier 2: Digi-Key; Supplier Part Number 2: MCP6L04T-E/STDKR-ND; Supplier 3: Digi-Key; Supplier Part Number 3: MCP6L04T-E/STCT-ND; Supplier 4: Newark; Supplier Part Number 4: 08R1815; ComponentLink1Description: Datasheet; ComponentLink1URL: http://ww1.microchip.com/downloads/en/DeviceDoc/22140a.pdf; ComponentLink2Description: Packaging Specification; ComponentLink2URL: http://www.microchip.com/stellent/groups/techpub_sg/documents/packagingspec/en012702.pdf; ComponentLink3Description: Microchip.com Home; ComponentLink3URL: http://www.microchip.com/
U6-U12 = ITR9909: Everlight Opto Interrupter; LayerSch: Top

## Sheet USB-power.SchDoc: Thymio2
size A4; Organization: Original design LSRO-STI-EPFL; Address1: Association Mobsya; Address2: Michael Bonani; Address3: Ch. Closel 3; Address4: CH-1020 Renens; DocumentNumber: 3; Revision: 2.3; SheetNumber: 3; SheetTotal: 9; Engineer: Michael Bonani; Title2: PCB principal; ProjectName: Project Name
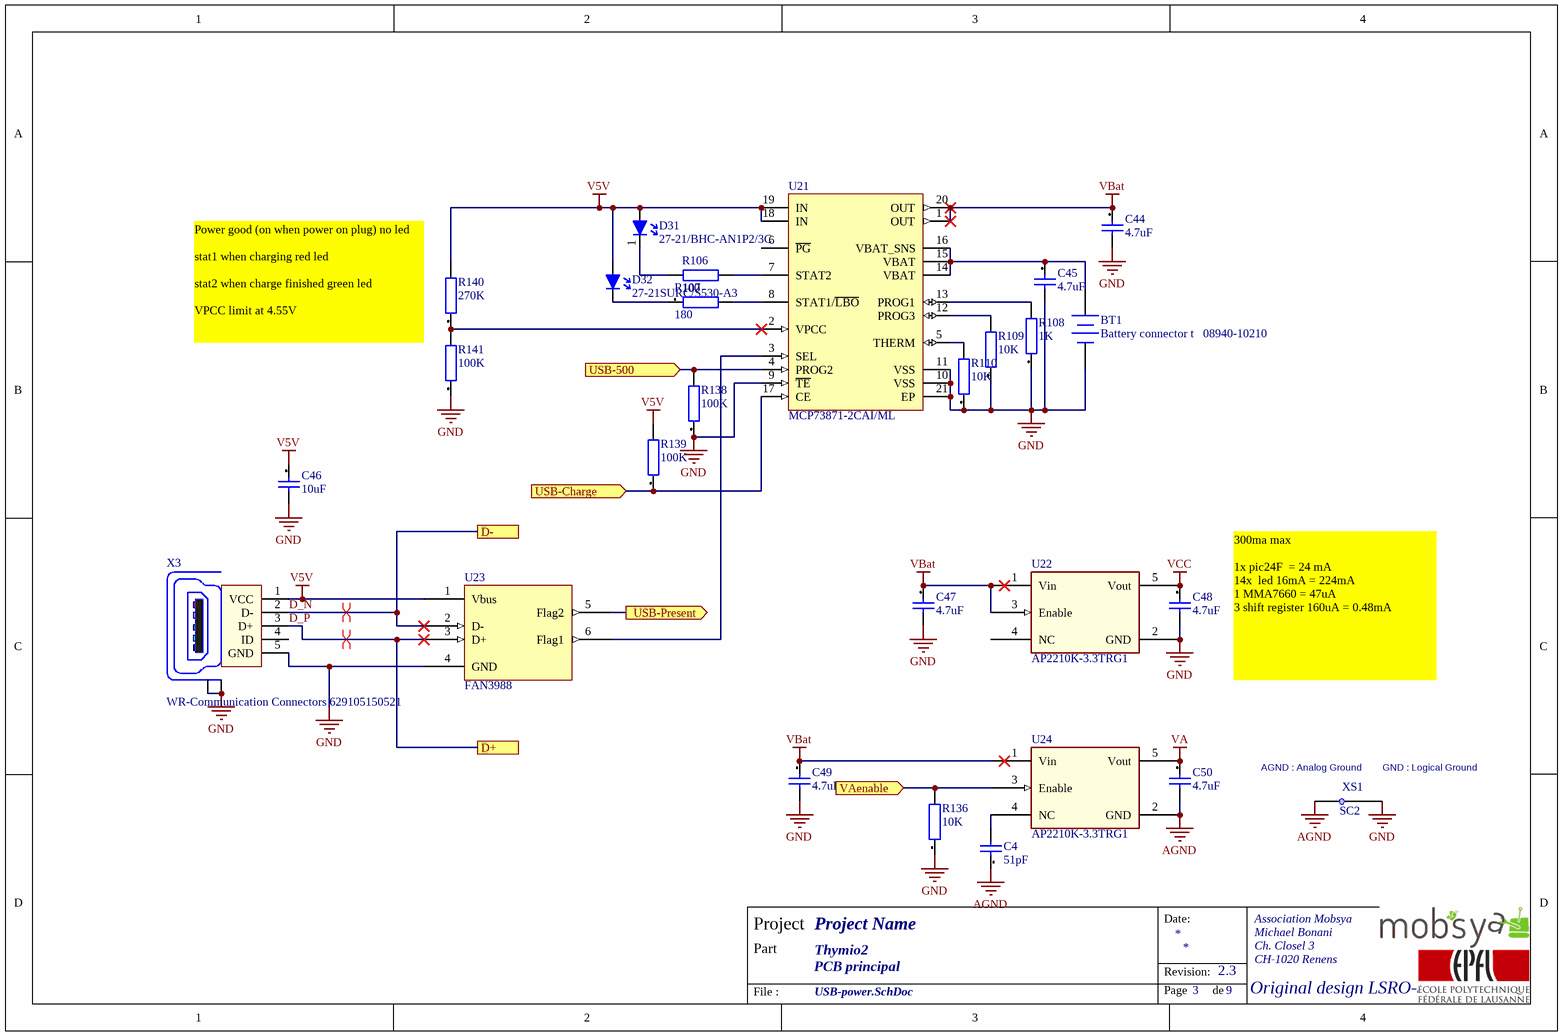
[diagram p3: USB-power.SchDoc]

### Parts
BT1  Battery connector t   08940-10210  [BAT-2]
C4  51pF  [CAPC1005X05N]
C44  4.7uF  [CAPC1005X05N]
C45  4.7uF  [CAPC1005X05N]
C46  10uF  [CAPC1005X05N]
C47  4.7uF  [CAPC1005X05N]
C48  4.7uF  [CAPC1005X05N]
C49  4.7uF  [CAPC1005X05N]
C50  4.7uF  [CAPC1005X05N]
D31  27-21/BHC-AN1P2/3C  [27-21 Everlight Blue]
D32  27-21SURC/S530-A3  [27-21 Everlight]
R106  100  [RESC1005X04N]
R107  180  [RESC1005X04N]
R108  1K  [RESC1005X04N]
R109  10K  [RESC1005X04N]
R110  10K  [RESC1005X04N]
R136  10K  [RESC1005X04N]
R138  100K  [RESC1005X04N]
R139  100K  [RESC1005X04N]
R140  270K  [RESC1005X04N]
R141  100K  [RESC1005X04N]
U21  MCP73871-2CAI/ML  [QFN-ML20_N]
U22  AP2210K-3.3TRG1  [SOT95P285X100-5N]
U23  FAN3988  [MLP 1.45x1mm]
U24  AP2210K-3.3TRG1  [SOT95P285X100-5N]
X3  WR-Communication Connectors 629105150521  [629105150521]
XS1  SC2  [CC_SC2]  (net tie, no BOM)

### Ports
D+, D-, USB-500 (in), USB-Charge (in), USB-Present (out), VAenable (in)

### Nets
AGND: C4.1 C50.2 U24.2(GND) XS1.2
GND: BT1.2(-) C44.2 C45.2 C46.2 C47.2 C48.2 C49.2 R108.1 R109.1 R110.1 R136.1 R138.1 R141.1 U21.9(~{TE}) U21.10(VSS) U21.11(VSS) U21.21(EP) U22.2(GND) U23.4(GND) X3.5(GND) X3.Z1(Shield) X3.Z2(Shield) XS1.1
V5V: C46.1 D31.2(A) D32.2(A) R139.2 R140.2 U21.18(IN) U21.19(IN) U23.1(Vbus) X3.1(VCC)
VA: C50.1 U24.5(Vout)
VBat: C44.1 C47.1 C49.1 U21.1(OUT) U21.20(OUT) U22.1(Vin) U22.3(Enable) U24.1(Vin)
VCC: C48.1 U22.5(Vout)
D_N: U23.2(D-) X3.2(D-) ; port D-
D_P: U23.3(D+) X3.3(D+) ; port D+
USB-500: R138.2 U21.4(PROG2) ; port USB-500
USB-Charge: R139.1 U21.17(CE) ; port USB-Charge
USB-Present: U23.5(Flag2) ; port USB-Present
VAenable: R136.2 U24.3(Enable) ; port VAenable
NetBT1_1: BT1.1(+) C45.1 U21.14(VBAT) U21.15(VBAT) U21.16(VBAT_SNS)
NetC4_2: C4.2 U24.4(NC)
NetD31_1: D31.1(K) R106.2
NetD32_1: D32.1(K) R107.1
NetR106_1: R106.1 U21.7(STAT2)
NetR107_2: R107.2 U21.8(STAT1/~{LBO})
NetR108_2: R108.2 U21.13(PROG1)
NetR109_2: R109.2 U21.12(PROG3)
NetR110_2: R110.2 U21.5(THERM)
NetR140_1: R140.1 R141.2 U21.2(VPCC)
NetU21_3: U21.3(SEL) U23.6(Flag1)

Not connected (* = marked no-connect by the designer): U21 6(~{PG}); U22 4(NC); X3 4(ID)

### Layout directives
differential pair: D_N, D_P

### Notes on the sheet
- Power good (on when power on plug) no led
  stat1 when charging red led
  stat2 when charge finished green led
  VPCC limit at 4.55V
- 300ma max
  1x pic24F		= 24 mA
  14x  led 16mA	= 224mA
  1 MMA7660	= 47uA
  3 shift register 160uA = 0.48mA
- (near XS1) AGND : Analog Ground
- (near XS1) GND : Logical Ground
- Date:
- Project
- Part
- Revision:
- File :
- Page
- de

### Library data of the parts
BT1 = Battery: Multicell Battery; LayerSch: Top; Published: 24-Mar-1999; LatestRevisionDate: 17-Jul-2002; LatestRevisionNote: Re-released for DXP Platform.; PackageReference: BAT-2; Publisher: Altium Limited
C4 = 10nF[[/\]]0603[[/\]]1: Capacitor; Manufacturer: Multicomp; Manufacturer Nr: U0603R103KCT; Preference: 1; Tolerance +: +10; Tolerance -: -10; Dielectric: X7R; Voltage: 50; MaxTemperature: +125; MinTemperature: -55; Quant_1: 10; Quant_2: 100; Quant_3: 1000; Currentie: CHF; LayerSch: Top; Size: 0603; Footprint Acort: 0603_G; Supplier: Farnell; Supplier Nr: 9406182; ComponentLink2Description: Farnell link; ComponentLink2URL: http://ch.farnell.com/jsp/displayProduct.jsp?sku=9406182; Price_1: 0.062; Price_2: 0.041; Price_3: 0.021; ROHS: True; DateLastUpdate: 2007-12-03 / 14:22:34
C44 C45 C47-C50 = 4.7uF[[/\]]0603[[/\]]1: Capacitor; Manufacturer: Kemet; Manufacturer Nr: C0603C475K9PAC; Preference: 1; Tolerance +: +10; Tolerance -: -10; Dielectric: X5R; Voltage: 6.3; MaxTemperature: +85; MinTemperature: -55; Quant_1: 10; Quant_2: 100; Quant_3: 1000; Quant_4: 4000; Currentie: CHF; LayerSch: Top; Size: 0603; Footprint Acort: 0603_G; Supplier: Farnell; Supplier Nr: 9227784; ComponentLink2Description: Farnell link; ComponentLink2URL: http://ch.farnell.com/jsp/displayProduct.jsp?sku=9227784; Price_1: 0.33; Price_2: 0.298; Price_3: 0.278; Price_4: 0.246; ROHS: True; DateLastUpdate: 2007-12-03 / 14:22:57
C46 = 10uF[[/\]]0603[[/\]]1: Capacitor; Manufacturer: Taiyo Yuden; Manufacturer Nr: JMK107BJ106MA-T; Preference: 1; Tolerance +: +15; Tolerance -: -15; Dielectric: X5R; Voltage: 6.3; MaxTemperature: +85; MinTemperature: -55; Quant_2: 100; Quant_3: 500; Currentie: CHF; LayerSch: Top; Size: 0603; Footprint Acort: 0603_G; Supplier: Farnell; Supplier Nr: 1463375; ComponentLink2Description: Farnell link; ComponentLink2URL: http://ch.farnell.com/jsp/displayProduct.jsp?sku=1463375; Quant_1: 1; Price_1: 0.768; Price_2: 0.674; Price_3: 0.372; ROHS: True; DateLastUpdate: 2007-12-03 / 14:22:36
D31 = LED: SMD Blue led right angle mount 3.3V@20ma 28mcd; VerifiedComment: ToDo; LayerSch: Top
D32 = LED: SMD Red led right angle mount 2V@20ma 57mcd; VerifiedComment: ToDo; LayerSch: Top
R106 = RES_ACORT: Resistance; ClassName: IR
R107 = 180R[[/\]]0603[[/\]]1: as R137 on sheet microcontroleur; Size: 0603; Footprint Acort: 0603; Supplier: Distrelec; Supplier Nr: 715570; ComponentLink2Description: Distrelec link; ComponentLink2URL: http://www.distrelec.com/ishopWebFront/search/luceneSearch.do?dispatch=find&showImage=on&artnrPhrase=715570; ROHS: True; Price_1: 0.0538; Price_2: 0.0323; Price_3: 0.0204; DateLastUpdate: 2007-12-03 / 16:30:19
R108 = 1K[[/\]]0603[[/\]]1: Resistor; Manufacturer: Vishay; Manufacturer Nr: D11CRCW06030B1001F; Tolerance: +/-1; Preference: 1; Power: 0.1; Voltage: 75; Current: 1.5; ppm/K: +/-100; Quant_1: 10; Quant_2: 100; Quant_3: 500; Currentie: CHF; LayerSch: Top; Size: 0603; Footprint Acort: 0603; Supplier: Distrelec; Supplier Nr: 715588; ComponentLink2Description: Distrelec link; ComponentLink2URL: http://www.distrelec.com/ishopWebFront/search/luceneSearch.do?dispatch=find&showImage=on&artnrPhrase=715588; ROHS: True; Price_1: 0.0753; Price_2: 0.0538; Price_3: 0.0215; DateLastUpdate: 2009-01-20 / 09:40:15
R109 R110 R141 = 10K[[/\]]0603[[/\]]1: Resistor; Manufacturer: Vishay; Manufacturer Nr: D11CRCW06030B1002F; Tolerance: +/-1; Preference: 1; Power: 0.1; Voltage: 75; Current: 1.5; ppm/K: +/-100; Quant_1: 10; Quant_2: 100; Quant_3: 500; Currentie: CHF; LayerSch: Top; Size: 0603; Footprint Acort: 0603; ComponentLink1Description: OnLine datasheet; Supplier: Distrelec; Supplier Nr: 715612; ComponentLink2Description: Distrelec link; ComponentLink2URL: http://www.distrelec.com/ishopWebFront/search/luceneSearch.do?dispatch=find&showImage=on&artnrPhrase=715612; ROHS: True; Price_1: 0.0538; Price_2: 0.0323; Price_3: 0.0204; DateLastUpdate: 2007-12-03 / 16:29:57
R136 = 10K[[/\]]0603[[/\]]2: as R101 on sheet microcontroleur; Size: 0603; Footprint Acort: 0603; ComponentLink1Description: OnLine datasheet; Supplier: Farnell; Supplier Nr: 9330399; ComponentLink2Description: Farnell link; ComponentLink2URL: http://ch.farnell.com/jsp/displayProduct.jsp?sku=9330399; ROHS: True; Quant_1: 50; Price_1: 0.062; Price_2: 0.049; Price_3: 0.038; Price_4: 0.027; Price_5: 0.021; DateLastUpdate: 2007-11-29 / 09:14:40
R138 R139 = 100K[[/\]]0603[[/\]]1: Resistor; Manufacturer: Vishay; Manufacturer Nr: D11CRCW06030B1003F; Tolerance: +/-1; Preference: 1; Power: 0.1; Voltage: 75; Current: 1.5; ppm/K: +/-100; Quant_1: 10; Quant_2: 100; Quant_3: 500; Currentie: CHF; LayerSch: Top; Size: 0603; Footprint Acort: 0603; ComponentLink1Description: OnLine datasheet; Supplier: Distrelec; Supplier Nr: 715636; ComponentLink2Description: Distrelec link; ComponentLink2URL: http://www.distrelec.com/ishopWebFront/search/luceneSearch.do?dispatch=find&showImage=on&artnrPhrase=715636; ROHS: True; Price_1: 0.0538; Price_2: 0.0323; Price_3: 0.0204; DateLastUpdate: 2007-12-03 / 16:29:58
R140 = 270K[[/\]]0603[[/\]]2: Resistor; Manufacturer: Multicomp; Manufacturer Nr: MC 0.063W 0603 1% 270K; Tolerance: +/-1; Preference: 2; Power: 0.063; Voltage: 50; Current: 1; ppm/K: +/-100; Quant_2: 250; Quant_3: 1000; Quant_4: 5000; Quant_5: 15000; Currentie: CHF; LayerSch: Top; Size: 0603; Footprint Acort: 0603; Supplier: Farnell; Supplier Nr: 9330941; ComponentLink2Description: Farnell link; ComponentLink2URL: http://ch.farnell.com/jsp/displayProduct.jsp?sku=9330941; ROHS: True; Quant_1: 50; Price_1: 0.062; Price_2: 0.049; Price_3: 0.038; Price_4: 0.027; Price_5: 0.021; DateLastUpdate: 2007-11-29 / 09:14:02
U21 = MCP73871-2AAI/ML: Stand-Alone System Load Sharing and Li-Ion/Li-Polymer Battery Charge Management Controller, 4.2V, 20-Pin QFN, Industrial Temperature; LayerSch: Top; FirstPublished: 29-Jan-2009; LatestRevisionDate: 27-Nov-2009; LatestRevisionNote: Updated to datasheet revision B, May-2009; DatasheetVersion: revB, May-2009; PackageVersion: revBB, Aug-2009; PackageReference: QFN-ML20; Publisher: Altium Limited; PackageDescription: 20-Lead Plastic Quad Flat, No Lead Package (ML) - 4x4x0.9 mm Body [QFN]; Supplier 1: Digi-Key; Supplier Part Number 1: MCP73871-2AAI/ML-ND; Supplier 2: Farnell; Supplier Part Number 2: 1642487; Supplier 3: Newark; Supplier Part Number 3: 54M4955; ComponentLink1Description: Datasheet; ComponentLink1URL: http://ww1.microchip.com/downloads/en/DeviceDoc/22090b.pdf; ComponentLink2Description: Packaging Specification; ComponentLink2URL: http://www.microchip.com/stellent/groups/techpub_sg/documents/packagingspec/en012702.pdf; ComponentLink3Description: Microchip.com Home; ComponentLink3URL: http://www.microchip.com/
U22 U24 = AP7331: 300mA, Low Quiescent Current, Fast Transient LDO; LayerSch: Top
U23 = FAN3988: USB/Charger and Over Voltage Detection Device; LayerSch: Top
X3 = WR-Communication Connectors 629105150521: WR-COM_USB_Micro Type B_Horizontal_SMT; Manufacturer: Würth Elektronik eiSos GmbH; ComponentLink1 Description: Manufacturer; ComponentLink2 Description: Datasheet; NoPins: 5; ComponentLink1URL: http://www.we-online.de; ComponentLink2URL: http://katalog.we-online.de/em/datasheet/629105150521.pdf; Created by: Karrer Zheng; Created Date: 10/21/2014; partNo: 629105150521
XS1 = SC2: Short Circuit 2 Connections; LayerSch: Top

## Sheet accelerometer.SchDoc: Thymio2
size A4; Engineer: Michael Bonani; Organization: Original design LSRO-STI-EPFL; Address1: Association Mobsya; Address2: Michael Bonani; Address3: Ch. Closel 3; Address4: CH-1020 Renens; DocumentNumber: 5; Revision: 2.3; SheetNumber: 5; SheetTotal: 9; Title2: PCB principal
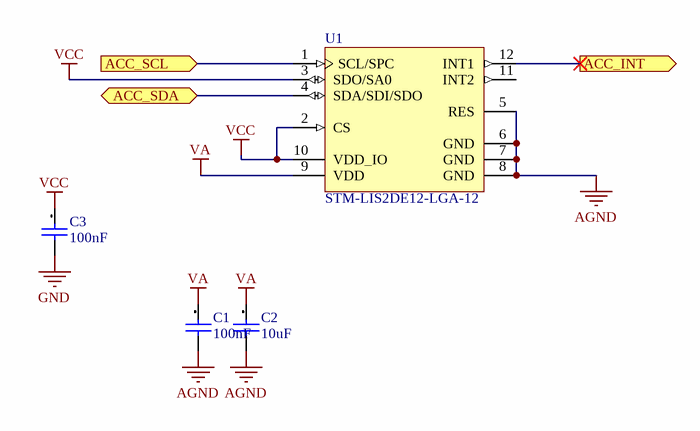
[diagram p4: accelerometer.SchDoc]

### Parts
C1  100nF  [CAPC1005X05N]
C2  10uF  [CAPC1005X05N]
C3  100nF  [CAPC1005X05N]
U1  STM-LIS2DE12-LGA-12  [STM-LGA-12]

### Ports
ACC_INT (out), ACC_SCL (in), ACC_SDA (bidir)

### Nets
AGND: C1.2 C2.2 U1.5(RES) U1.6(GND) U1.7(GND) U1.8(GND)
GND: C3.2
VA: C1.1 C2.1 U1.9(VDD)
VCC: C3.1 U1.2(CS) U1.3(SDO/SA0) U1.10(VDD_IO)
ACC_INT: U1.12(INT1) ; port ACC_INT
SCL: U1.1(SCL/SPC) ; port ACC_SCL
SDA: U1.4(SDA/SDI/SDO) ; port ACC_SDA

Not connected (* = marked no-connect by the designer): U1 11(INT2)

### Notes on the sheet
- Date:
- Project
- Part
- Revision:
- File :
- Page
- de

### Library data of the parts
C1 C3 = 100nF[[/\]]0603[[/\]]1: as C33 on sheet microcontroleur; Size: 0603; Footprint Acort: 0603_G; Supplier: Farnell; Supplier Nr: 1288255; ComponentLink2Description: Farnell link; ComponentLink2URL: http://ch.farnell.com/jsp/displayProduct.jsp?sku=1288255; Price_1: 0.046; Price_2: 0.04; Price_3: 0.037; Price_4: 0.036; ROHS: True; DateLastUpdate: 2007-12-03 / 14:22:31
C2 = 10uF[[/\]]0603[[/\]]1: as C46 on sheet USB-power; Size: 0603; Footprint Acort: 0603_G; Supplier: Farnell; Supplier Nr: 1463375; ComponentLink2Description: Farnell link; ComponentLink2URL: http://ch.farnell.com/jsp/displayProduct.jsp?sku=1463375; Quant_1: 1; Price_1: 0.768; Price_2: 0.674; Price_3: 0.372; ROHS: True; DateLastUpdate: 2007-12-03 / 14:22:36
U1 = STM-LIS2HH12-LGA-12